# EAGLE design phantom_power (EAGLE 9.6.2)
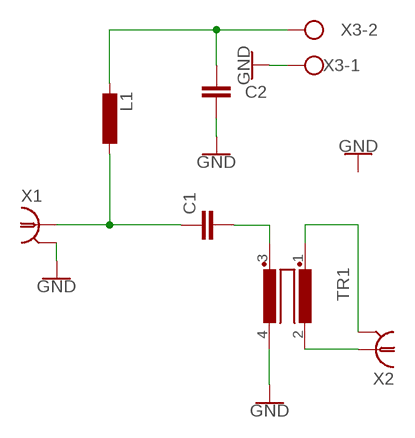
[diagram p0: schematic, sheet 1]

## Parts
C1  C-EUC1206K  [C1206K]
C2  C-EUC1206K  [C1206K]
L1  L-EU6000-XXX-RC  [6000-XXXX-RC]
TR1  R1405UB1/2  [B1/2]
X1  227161-8  [AMP_227161]
X2  227161-8  [AMP_227161]
X3  W237-102  [W237-102]

## Nets
GND: C2.2 TR1.4 X1.2 X3.1
N$1: C1.1 L1.1 X1.1
N$2: C2.1 L1.2 X3.2
N$3: C1.2 TR1.3
N$4: TR1.2 X2.1
N$5: TR1.1 X2.2

## Library data of the parts
C1 C2 = rcl:C-EU: CAPACITOR, European symbol; SPICEPREFIX: C
L1 = rcl:L-EU: INDUCTOR, European symbol; SPICEPREFIX: L
TR1 = inductor-nkl:R1405U: Gleichtakt-Entstördrossel (über typ. 5MHz) common mode choke (above typ.5MHz); OC_FARNELL: unknown; OC_NEWARK: unknown
X1 X2 = con-coax:?227161*: JACK, RIGHT ANGLE, 50 OHM, PCB, BNC Source: amp_227161.pdf; OC_FARNELL: unknown; OC_NEWARK: unknown
X3 = con-wago-500:W237-102: WAGO SCREW CLAMP; MPN: 237-102; OC_FARNELL: unknown; OC_NEWARK: 70K9898

## Board
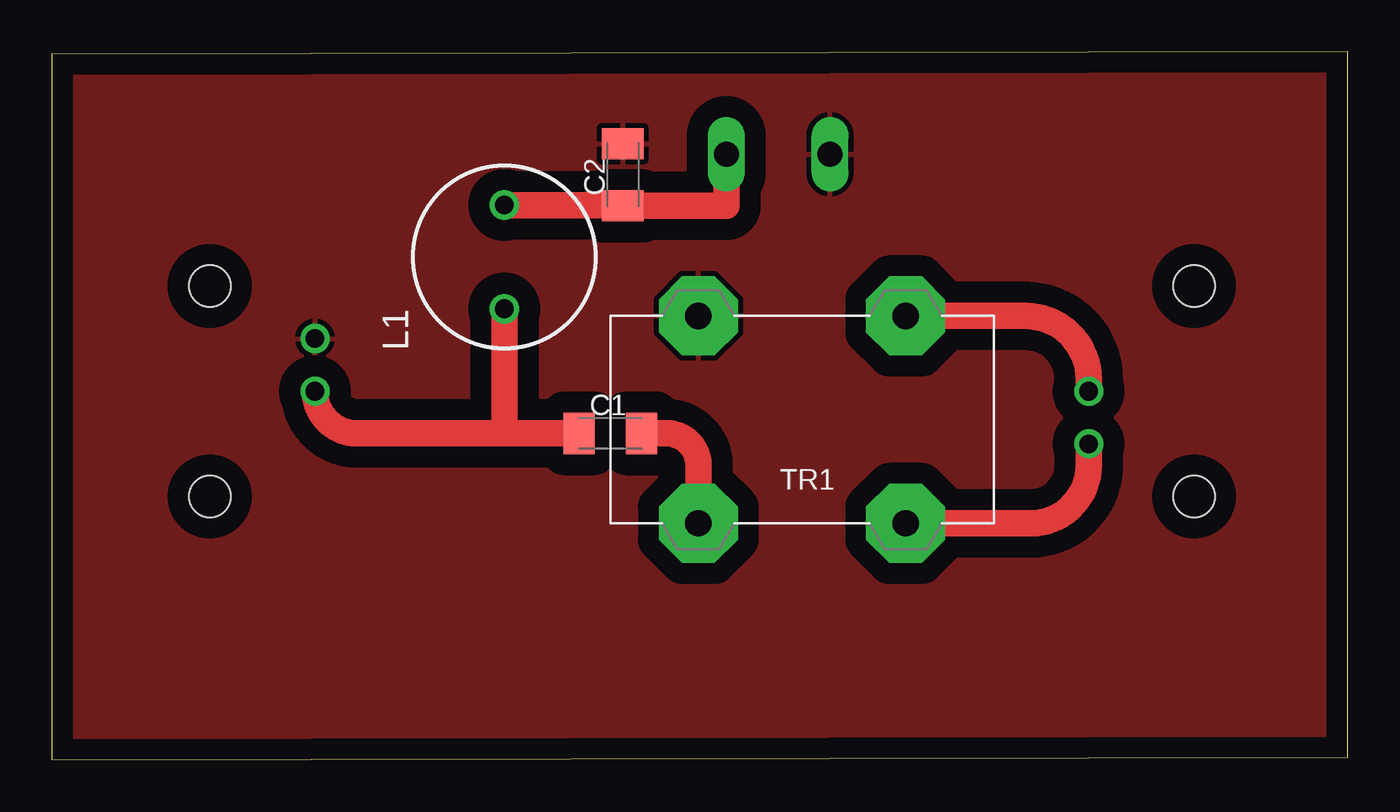
[diagram p1: board, top side]
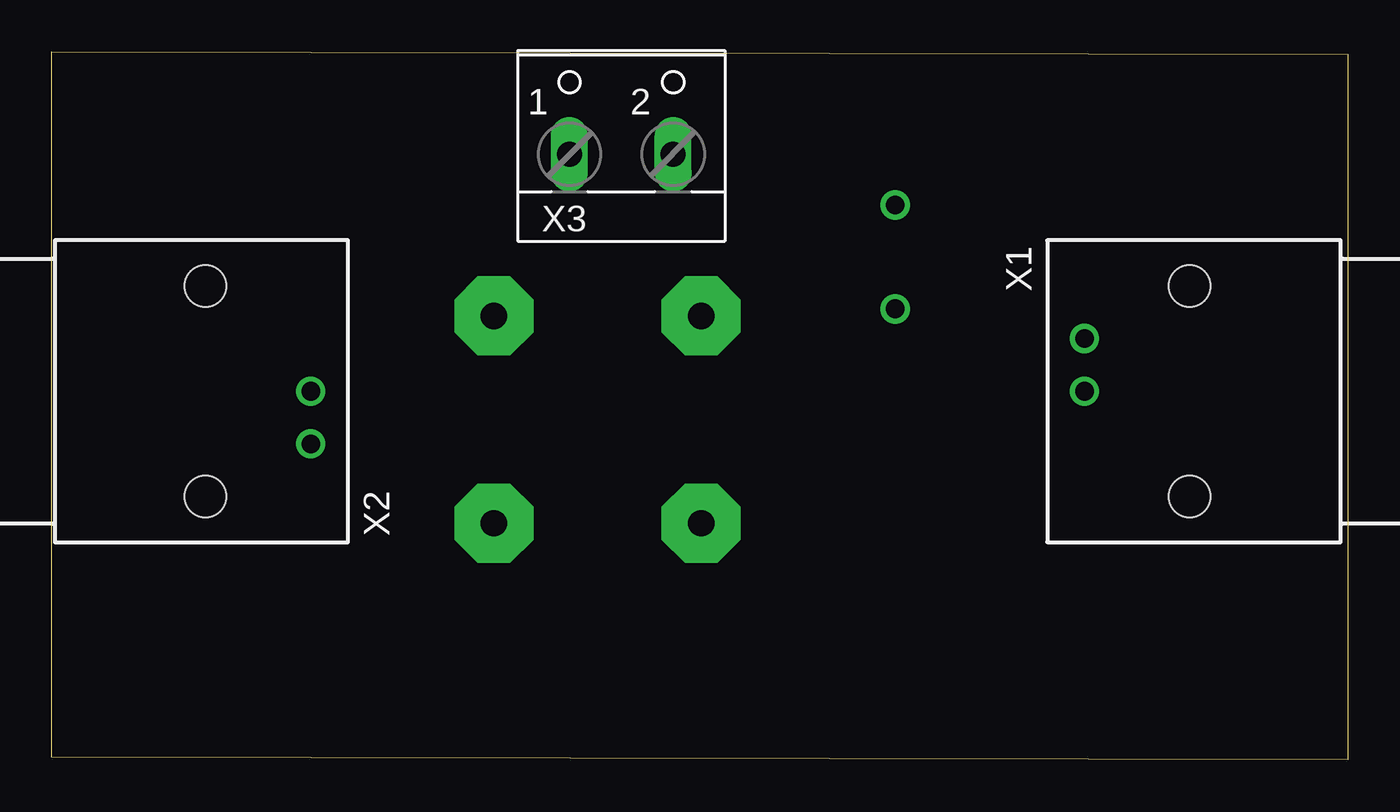
[diagram p2: board, bottom side, seen from below]

Size 62.53 x 34.15 mm. Coordinates in mm from the lower left corner, seen from the top.
Outline: 0,0 62.53,0.13 62.53,34.15 0,34.03 0,0
Copper layers (1*16): Top 0.035mm / dielectric 1.5mm / Bottom 0.035mm
Design rules "default": minimum track width 6mil, minimum drill 0.35mm, track to track 6mil, track to pad 6mil, pad to pad 6mil, via to via 6mil, smd to smd 6mil, copper to edge 40mil, drill to drill 6mil, minimum pad ring 10mil, minimum via ring 8mil, stop-mask expansion 4mil, vias tented up to drill 0mil, thermal gap 10mil

### Footprints (pad centres in the part's own frame; a part is rotated, then mirrored left to right if it is on the bottom)
C1206K = smd 1.5 x 2: 1 -1.5,0; 2 1.5,0
6000-XXXX-RC = drill 0.9 pad 1.422: 1 -2.5,0; 2 2.5,0
B1/2 = drill 1.27 pad 3.81 octagon: 1 -5,5; 2 -5,-5; 3 5,5; 4 5,-5
AMP_227161 = drill 0.9 pad 1.27: 1 0,-5.08; 2 -2.54,-5.08 | hole 2: -5.08,0; 5.08,0
W237-102 = drill 1.194 long: 1 -2.5,-1.27; 2 2.5,-1.27

### Placement (x,y rotation side)
C1  26.95,15.75 0 top
C2  27.56,28.22 90 top
L1  21.84,24.26 90 top
TR1  36.2,16.41 180 top
X1  7.62,17.78 270 bottom
X2  55.12,17.78 90 bottom
X3  35.05,30.48 0 bottom

### Tracks (layer width: path | path; a pad name or v marks a point on that pad's centre or on a via)
GND
  pour Top (isolate 1.016): -1.27,35.56 -1.27,-1.27 64.77,-1.27 64.77,35.56
N$1
  Top 1.27: X1.1 arc90 14.73,15.75 21.84,15.75 | 21.84,15.75 C1.1 | L1.1 21.84,15.75
N$2
  Top 1.27: L1.2 27.56,26.76 C2.1 32.55,26.72 X3.2
N$3
  Top 1.27: C1.2 29.68,15.75 arc-90 31.2,14.22 TR1.3
N$4
  Top 1.27: X2.1 50.04,18.36 arc90 46.99,21.41 TR1.2
N$5
  Top 1.27: TR1.1 47.24,11.41 arc90 50.04,14.2 X2.2